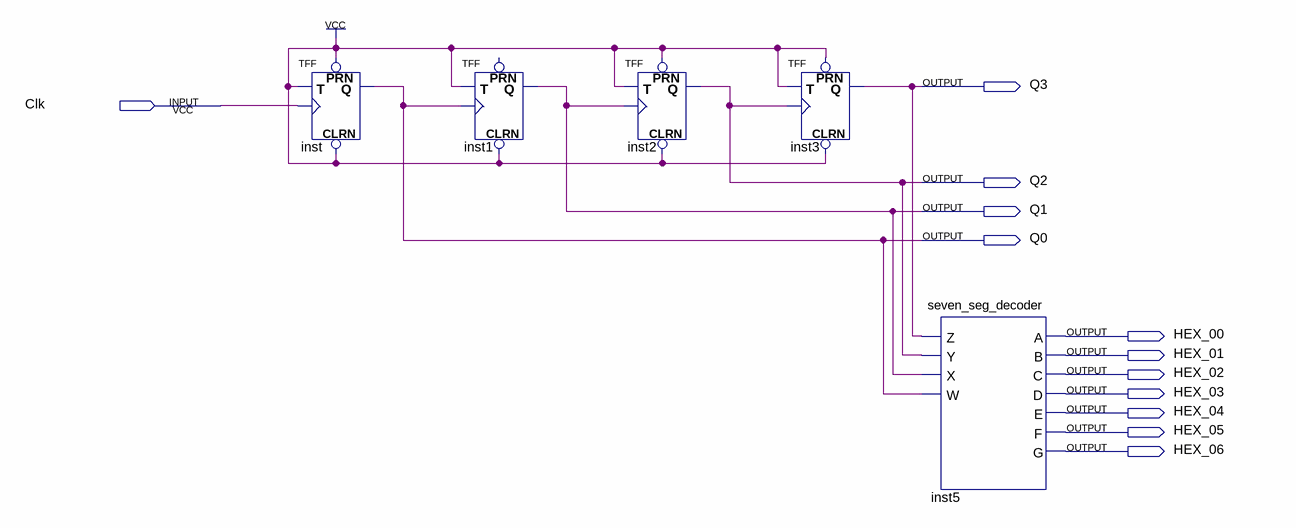
[diagram p0: schematic sheet]
// Quartus schematic lab10step3b.bdf as structural Verilog: 5 symbols, 12 pins
module lab10step3b (
  input  Clk,
  output Q3,
  output Q2,
  output Q1,
  output Q0,
  output HEX_00,
  output HEX_01,
  output HEX_02,
  output HEX_03,
  output HEX_04,
  output HEX_05,
  output HEX_06
);

  TFF inst (.PRN(1'b1), .CLRN(1'b1), .T(1'b1), .CLK(Clk), .Q(Q0));
  TFF inst1 (.CLRN(1'b1), .T(1'b1), .CLK(Q0), .Q(Q1));  // open: PRN
  TFF inst2 (.PRN(1'b1), .CLRN(1'b1), .T(1'b1), .CLK(Q1), .Q(Q2));
  TFF inst3 (.PRN(1'b1), .CLRN(1'b1), .T(1'b1), .CLK(Q2), .Q(Q3));
  seven_seg_decoder inst5 (
    .Z(Q3), .Y(Q2), .X(Q1), .W(Q0), .A(HEX_00), .B(HEX_01), .C(HEX_02), .D(HEX_03), .E(HEX_04), .F(HEX_05),
    .G(HEX_06));
endmodule
